# EAGLE design mcp23s08 (EAGLE 6.4)
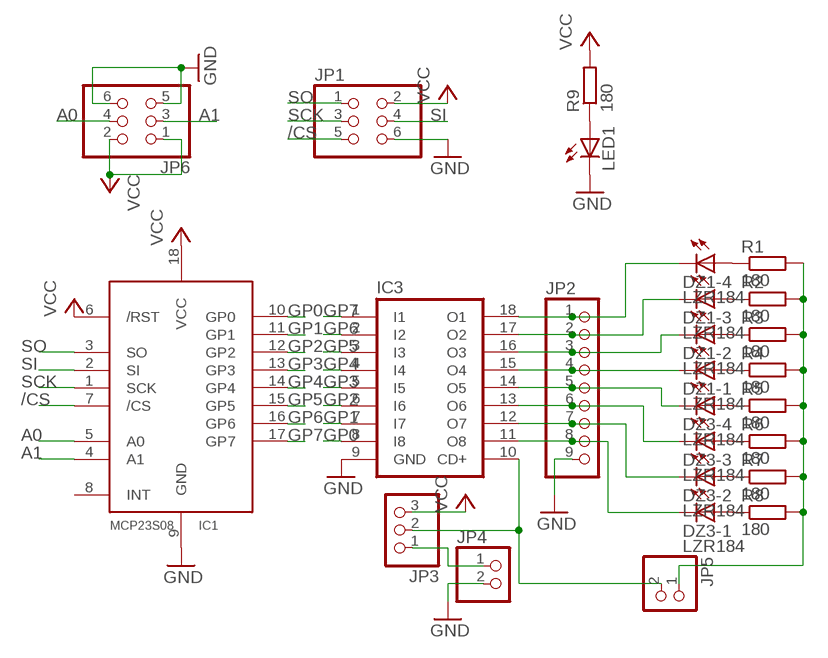
[diagram p0: schematic, sheet 1]

## Parts
DZ1  LZR184  [LZR184]
DZ3  LZR184  [LZR184]
IC1  MCP2300X/P  [DIL18]
IC3  ULN2803A  [DIL18]
JP1  PINHD-2X3  [2X03]
JP2  PINHD-1X9  [1X09]
JP3  PINHD-1X3  [1X03]
JP4  PINHD-1X2  [1X02]
JP5  PINHD-1X2  [1X02]
JP6  PINHD-2X3  [2X03]
LED1  LED3MM  [LED3MM]
R1  180  R-EU_0204/2V  [0204V]
R2  180  R-EU_0204/2V  [0204V]
R3  180  R-EU_0204/2V  [0204V]
R4  180  R-EU_0204/2V  [0204V]
R5  180  R-EU_0204/2V  [0204V]
R6  180  R-EU_0204/2V  [0204V]
R7  180  R-EU_0204/2V  [0204V]
R8  180  R-EU_0204/2V  [0204V]
R9  180  R-EU_0204/2V  [0204V]

## Nets
/CS: IC1.7(/CS) JP1.5
A0: IC1.5(A0) JP6.4
A1: IC1.4(A1) JP6.3
GND: IC1.9(GND) IC3.9(GND) JP1.6 JP2.9 JP4.2 JP6.5 JP6.6 LED1.K(C)
GP0: IC1.10(GP0) IC3.8(I8)
GP1: IC1.11(GP1) IC3.7(I7)
GP2: IC1.12(GP2) IC3.6(I6)
GP3: IC1.13(GP3) IC3.5(I5)
GP4: IC1.14(GP4) IC3.4(I4)
GP5: IC1.15(GP5) IC3.3(I3)
GP6: IC1.16(GP6) IC3.2(I2)
GP7: IC1.17(GP7) IC3.1(I1)
N$1: JP5.1 R1.2 R2.2 R3.2 R4.2 R5.2 R6.2 R7.2 R8.2
N$2: LED1.A R9.1
N$10: DZ1.K4(-4:C) IC3.18(O1) JP2.1
N$11: DZ1.K3(-3:C) IC3.17(O2) JP2.2
N$12: DZ1.K2(-2:C) IC3.16(O3) JP2.3
N$13: DZ1.K1(-1:C) IC3.15(O4) JP2.4
N$14: DZ3.K4(-4:C) IC3.14(O5) JP2.5
N$15: DZ3.K3(-3:C) IC3.13(O6) JP2.6
N$16: DZ3.K2(-2:C) IC3.12(O7) JP2.7
N$17: DZ3.K1(-1:C) IC3.11(O8) JP2.8
N$18: JP3.1 JP4.1
N$20: IC3.10(CD+) JP3.2 JP5.2
N$36: DZ1.A4(-4:A) R1.1
N$37: DZ1.A3(-3:A) R2.1
N$38: DZ1.A2(-2:A) R3.1
N$39: DZ1.A1(-1:A) R4.1
N$40: DZ3.A4(-4:A) R5.1
N$41: DZ3.A3(-3:A) R6.1
N$42: DZ3.A2(-2:A) R7.1
N$43: DZ3.A1(-1:A) R8.1
SCK: IC1.1(SCK) JP1.3
SI: IC1.2(SI) JP1.4
SO: IC1.3(SO) JP1.1
VCC: IC1.6(/RST) IC1.18(VCC) JP1.2 JP3.3 JP6.1 JP6.2 R9.2
Unconnected: IC1.8(INT)

## Library data of the parts
DZ1 DZ3 = led:LZR184: LED BLOCK 4 LEDs, Siemens
IC1 = adafruit:MCP2300X: MCP23S08 Inexpensive SPI i/o expander - 8 general purpose i/o pins with optional pullups
IC3 = uln-udn:ULN2803A: DRIVER ARRAY
JP1 JP6 = pinhead:PINHD-2X3: PIN HEADER
JP2 = pinhead:PINHD-1X9: PIN HEADER
JP3 = pinhead:PINHD-1X3: PIN HEADER
JP4 JP5 = pinhead:PINHD-1X2: PIN HEADER
LED1 = led:LED: LED OSRAM: - CHIPLED LG R971, LG N971, LY N971, LG Q971, LY Q971, LO R971, LY R971 LH N974, LH R974 LS Q976, LO Q976, LY Q976 LO Q996 - Hyper CHIPLED LW Q18S LB Q993, LB Q99A, LB R99A - SideLED LS A670, LO A670, LY A670, LG A670, LP A670 LB A673, LV A673, LT A673, LW A673 LH A674 LY A675 LS A676, LA A676, LO A676, LY A676, LW A676 LS A679, LY A679, LG A679 - Hyper Micro SIDELED® LS Y876, LA Y876, LO Y876, LY Y876 LT Y87S - SmartLED LW L88C, LW L88S LB L89C, LB L89S, LG L890 LS L89K, LO L89K, LY L89K LS L896, LA L896, LO L896, LY L896 - TOPLED LS T670, LO T670, LY T670, LG T670, LP T670 LSG T670, LSP T670, LSY T670, LOP T670, LYG T670 LG T671, LOG T671, LSG T671 LB T673, LV T673, LT T673, LW T673 LH T674 LS T676, LA T676, LO T676, LY T676, LB T676, LH T676, LSB T676, LW T676 LB T67C, LV T67C, LT T67C, LS T67K, LO T67K, LY T67K, LW E67C LS E67B, LA E67B, LO E67B, LY E67B, LB E67C, LV E67C, LT E67C LW T67C LS T679, LY T679, LG T679 LS T770, LO T770, LY T770, LG T770, LP T770 LB T773, LV T773, LT T773, LW T773 LH T774 LS E675, LA E675, LY E675, LS T675 LS T776, LA T776, LO T776, LY T776, LB T776 LHGB T686 LT T68C, LB T68C - Hyper Mini TOPLED® LB M676 - Mini TOPLED Santana® LG M470 LS M47K, LO M47K, LY M47K Source: http://www.osram.convergy.de LUXEON: - LUMILED® LXK2-PW12-R00, LXK2-PW12-S00, LXK2-PW14-U00, LXK2-PW14-V00 LXK2-PM12-R00, LXK2-PM12-S00, LXK2-PM14-U00 LXK2-PE12-Q00, LXK2-PE12-R00, LXK2-PE12-S00, LXK2-PE14-T00, LXK2-PE14-U00 LXK2-PB12-K00, LXK2-PB12-L00, LXK2-PB12-M00, LXK2-PB14-N00, LXK2-PB14-P00, LXK2-PB14-Q00 LXK2-PR12-L00, LXK2-PR12-M00, LXK2-PR14-Q00, LXK2-PR14-R00 LXK2-PD12-Q00, LXK2-PD12-R00, LXK2-PD12-S00 LXK2-PH12-R00, LXK2-PH12-S00 LXK2-PL12-P00, LXK2-PL12-Q00, LXK2-PL12-R00 Source: www.luxeon.com KINGBRIGHT: KA-3528ASYC Source: www.kingbright.com
R1-R9 = resistor:R-EU_: RESISTOR, European symbol

## Board
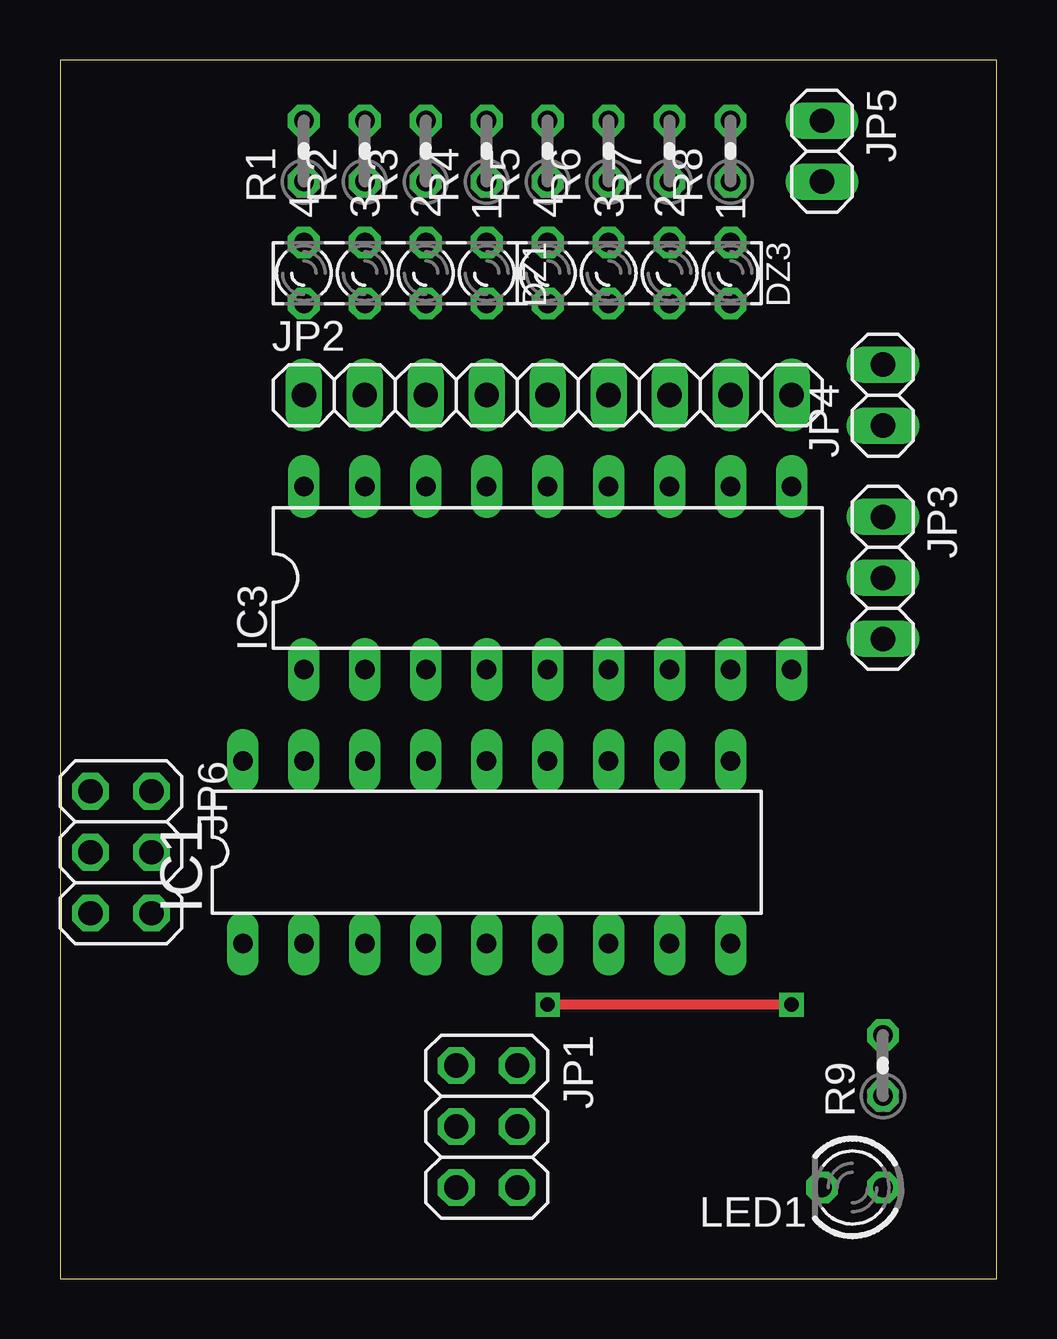
[diagram p1: board, top side]
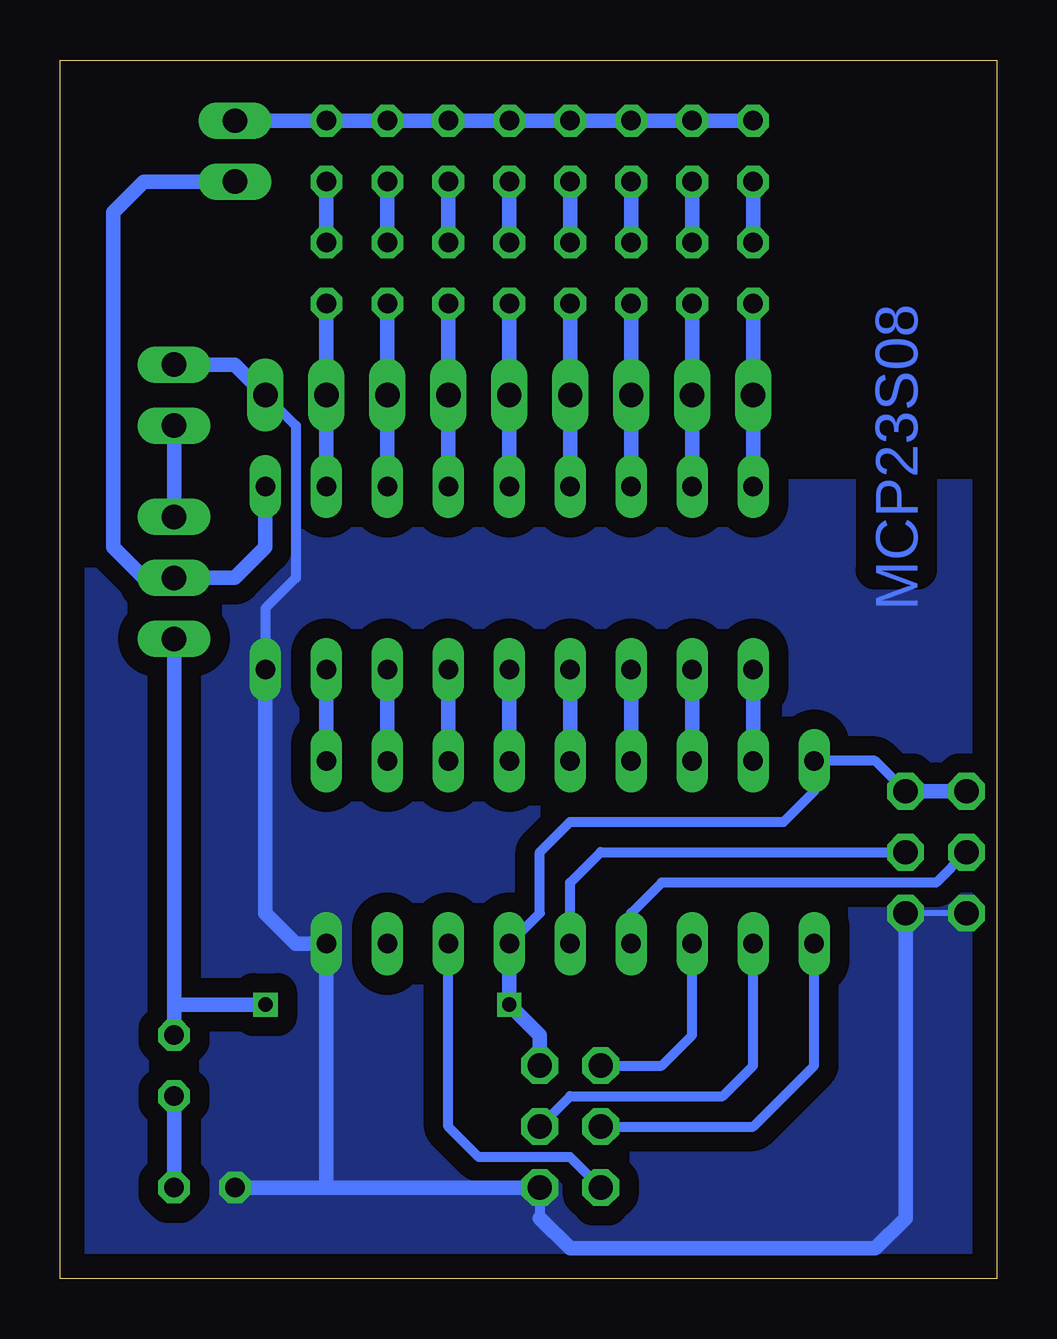
[diagram p2: board, bottom side, seen from below]

Size 39.04 x 50.79 mm. Coordinates in mm from the lower left corner, seen from the top.
Outline: 0,0 39.04,0 39.04,50.79 0,50.79 0,0
Copper layers (1*16): Top 0.035mm / dielectric 1.5mm / Bottom 0.035mm
Design rules "default": minimum track width 10mil, minimum drill 24mil, track to track 8mil, track to pad 8mil, pad to pad 8mil, via to via 8mil, smd to smd 8mil, copper to edge 40mil, drill to drill 8mil, minimum pad ring 10mil, minimum via ring 8mil, stop-mask expansion 4mil, vias tented up to drill 0mil, thermal gap 10mil

### Footprints (pad centres in the part's own frame; a part is rotated, then mirrored left to right if it is on the bottom)
LZR184 = drill 0.813 octagon: A1 -1.27,3.81; A2 -1.27,1.27; A3 -1.27,-1.27; A4 -1.27,-3.81; K1 1.27,3.81; K2 1.27,1.27; K3 1.27,-1.27; K4 1.27,-3.81
DIL18 = drill 0.813 long: 1 -10.16,-3.81; 2 -7.62,-3.81; 3 -5.08,-3.81; 4 -2.54,-3.81; 5 0,-3.81; 6 2.54,-3.81; 7 5.08,-3.81; 8 7.62,-3.81; 9 10.16,-3.81; 10 10.16,3.81; 11 7.62,3.81; 12 5.08,3.81; 13 2.54,3.81; 14 0,3.81; 15 -2.54,3.81; 16 -5.08,3.81; 17 -7.62,3.81; 18 -10.16,3.81
2X03 = drill 1.016 octagon: 1 -2.54,-1.27; 2 -2.54,1.27; 3 0,-1.27; 4 0,1.27; 5 2.54,-1.27; 6 2.54,1.27
1X09 = drill 1.016 long: 1 -10.16,0; 2 -7.62,0; 3 -5.08,0; 4 -2.54,0; 5 0,0; 6 2.54,0; 7 5.08,0; 8 7.62,0; 9 10.16,0
1X03 = drill 1.016 long: 1 -2.54,0; 2 0,0; 3 2.54,0
1X02 = drill 1.016 long: 1 -1.27,0; 2 1.27,0
LED3MM = drill 0.813 octagon: A -1.27,0; K 1.27,0
0204V = drill 0.813 octagon: 1 -1.27,0; 2 1.27,0

### Placement (x,y rotation side)
DZ1  13.97,41.91 270 top
DZ3  24.13,41.91 270 top
IC1  17.78,17.78 0 top
IC3  20.32,29.21 0 top
JP1  17.78,6.35 270 top
JP2  20.32,36.83 0 top
JP3  34.29,29.21 270 top
JP4  34.29,36.83 90 top
JP5  31.75,46.99 270 top
JP6  2.54,17.78 270 top
LED1  33.02,3.81 180 top
R1  10.16,46.99 90 top
R2  12.7,46.99 90 top
R3  15.24,46.99 90 top
R4  17.78,46.99 90 top
R5  20.32,46.99 90 top
R6  22.86,46.99 90 top
R7  25.4,46.99 90 top
R8  27.94,46.99 90 top
R9  34.29,8.89 90 top

### Tracks (layer width: path | path; a pad name or v marks a point on that pad's centre or on a via)
/CS
  Bottom 0.406: JP1.5 17.78,5.08 21.59,5.08 22.86,6.35 IC1.7
A0
  Bottom 0.406: IC1.5 17.78,16.51 16.51,17.78 JP6.4
A1
  Bottom 0.406: JP6.3 2.54,16.51 13.97,16.51 15.24,15.24 IC1.4
GND
  Bottom 0.254: JP6.5 JP6.6
  Bottom 0.406: JP1.6 19.05,2.54 | JP2.9 29.21,35.56 29.21,29.21 30.48,27.94 IC3.9
  Bottom 0.61: 19.05,2.54 17.78,1.27 5.08,1.27 3.81,2.54 JP6.6 | JP1.6 27.94,3.81 | 27.94,3.81 IC1.9 29.21,13.97 30.48,15.24 IC3.9 | JP4.2 31.75,38.1 JP2.9 | LED1.K 27.94,3.81
  pour Bottom (isolate 0.813, no thermals): 39.37,0 0,0 0,33.02 39.37,33.02
GP0
  Bottom 0.61: IC3.8 IC1.10
GP1
  Bottom 0.61: IC3.7 IC1.11
GP2
  Bottom 0.61: IC3.6 IC1.12
GP3
  Bottom 0.61: IC3.5 IC1.13
GP4
  Bottom 0.61: IC3.4 IC1.14
GP5
  Bottom 0.61: IC3.3 IC1.15
GP6
  Bottom 0.61: IC3.2 IC1.16
GP7
  Bottom 0.61: IC3.1 IC1.17
N$1
  Bottom 0.61: R1.2 R2.2 R3.2 R4.2 R5.2 R6.2 R7.2 R8.2 JP5.1
N$2
  Bottom 0.61: R9.1 LED1.A
N$10
  Bottom 0.61: IC3.18 JP2.1 DZ1.K4
N$11
  Bottom 0.61: IC3.17 JP2.2 DZ1.K3
N$12
  Bottom 0.61: IC3.16 JP2.3 DZ1.K2
N$13
  Bottom 0.61: IC3.15 JP2.4 DZ1.K1
N$14
  Bottom 0.61: IC3.14 JP2.5 DZ3.K4
N$15
  Bottom 0.61: IC3.13 JP2.6 DZ3.K3
N$16
  Bottom 0.61: IC3.12 JP2.7 DZ3.K2
N$17
  Bottom 0.61: IC3.11 JP2.8 DZ3.K1
N$18
  Bottom 0.61: JP3.1 JP4.1
N$20
  Bottom 0.406: JP3.2 35.56,29.21
  Bottom 0.61: JP3.2 31.75,29.21 30.48,30.48 IC3.10 | 35.56,29.21 36.83,30.48 36.83,44.45 35.56,45.72 JP5.2
N$36
  Bottom 0.61: R1.1 DZ1.A4
N$37
  Bottom 0.61: R2.1 DZ1.A3
N$38
  Bottom 0.61: R3.1 DZ1.A2
N$39
  Bottom 0.61: R4.1 DZ1.A1
N$40
  Bottom 0.61: R5.1 DZ3.A4
N$41
  Bottom 0.61: R6.1 DZ3.A3
N$42
  Bottom 0.61: R7.1 DZ3.A2
N$43
  Bottom 0.61: R8.1 DZ3.A1
SCK
  Bottom 0.406: JP1.3 10.16,6.35 7.62,8.89 IC1.1
SI
  Bottom 0.406: JP1.4 17.78,7.62 11.43,7.62 10.16,8.89 IC1.2
SO
  Bottom 0.406: JP1.1 13.97,8.89 12.7,10.16 IC1.3
VCC  (via drill 0.6)
  Top 0.406: v30.48,11.43 v20.32,11.43
  Bottom 0.406: JP6.2 5.08,21.59 IC1.18 7.62,20.32 8.89,19.05 17.78,19.05 19.05,17.78 19.05,15.24 IC1.6
  Bottom 0.61: JP6.1 JP6.2 | JP3.3 34.29,11.43 | 34.29,11.43 v30.48,11.43 | IC1.6 v20.32,11.43 19.05,10.16 JP1.2 | R9.2 34.29,11.43

### Text on the board
Bottom: MCP23S08